# EAGLE schematic board (EAGLE 8.7.1)
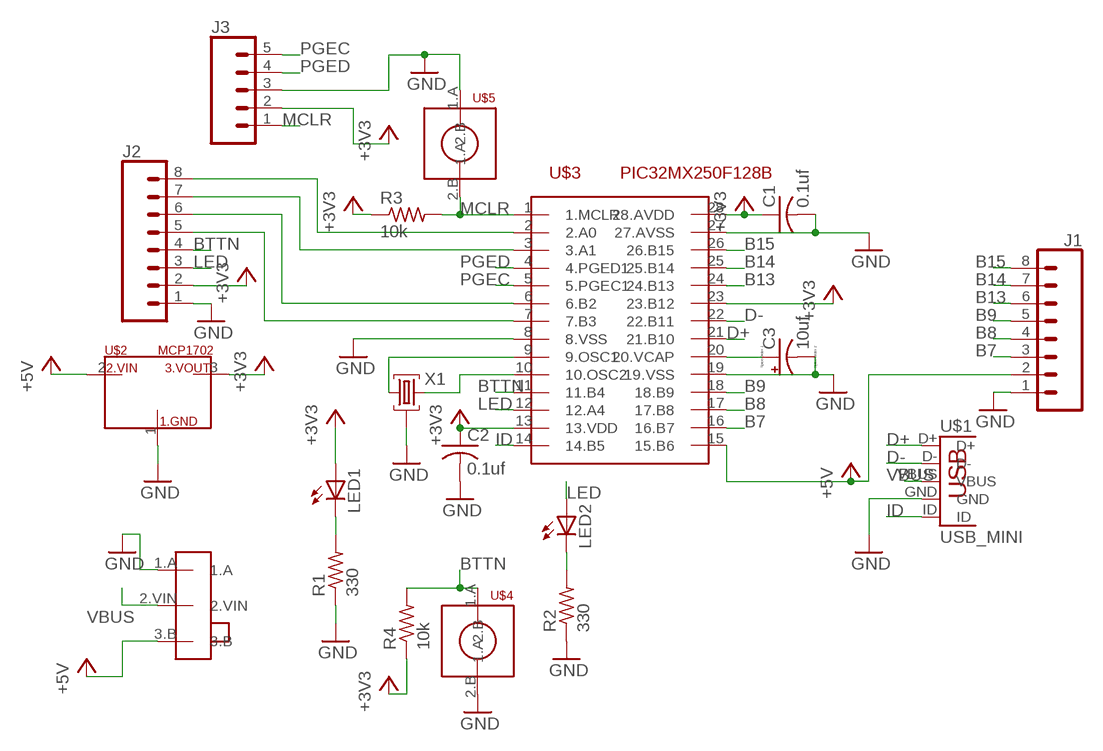
[diagram p0: schematic, sheet 1]

## Parts
C1  0.1uf  C-US025-025X050  [C025-025X050]
C2  0.1uf  C-US025-025X050  [C025-025X050]
C3  10uf  CPOL-USE2,5-6E  [E2,5-6E]
J1  CONN_08"  [1X08]
J2  CONN_08"  [1X08]
J3  CONN_05  [1X05]
LED1  LED5MM  [LED5MM]
LED2  LED5MM  [LED5MM]
R1  330  R-US_0204/5  [0204/5]
R2  330  R-US_0204/5  [0204/5]
R3  10k  R-US_0204/5  [0204/5]
R4  10k  R-US_0204/5  [0204/5]
U$1  USB_MINI  [USB-MB-H]
U$2  MCP1702  [TO92]
U$3  PIC32MX250F128B  [DIL28]
U$4  PUSH_BUTTON  [PUSH_BUTTON]
U$5  PUSH_BUTTON  [PUSH_BUTTON]
U$6  SLIDE_SWITCH  [SLIDE_SWITCH]
X1  HC49-HC49-3L  [HC49-3L]

## Nets
+3V3: C1.1 C2.1 J2.2 J3.2 LED1.A R3.1 R4.1 U$2.3(3.VOUT) U$3.13(13.VDD) U$3.23(23.B12) U$3.28(28.AVDD)
+5V: J1.2 U$2.2(2.VIN) U$3.15(15.B6) U$6.3.B
B7: J1.3 U$3.16(16.B7)
B8: J1.4 U$3.17(17.B8)
B9: J1.5 U$3.18(18.B9)
B13: J1.6 U$3.24(24.B13)
B14: J1.7 U$3.25(25.B14)
B15: J1.8 U$3.26(26.B15)
BTTN: J2.4 R4.2 U$3.11(11.B4) U$4.1.A
D+: U$1.D+ U$3.21(21.B10)
D-: U$1.D- U$3.22(22.B11)
GND: C1.2 C2.2 C3.- J1.1 J2.1 J3.3 R1.1 R2.1 U$1.GND U$2.1(1.GND) U$3.8(8.VSS) U$3.19(19.VSS) U$3.27(27.AVSS) U$4.2.B U$5.1.A U$6.1.A X1.2
ID: U$1.ID U$3.14(14.B5)
LED: J2.3 LED2.A U$3.12(12.A4)
MCLR: J3.1 R3.2 U$3.1(1.MCLR) U$5.2.B
N$1: LED1.K(C) R1.2
N$2: LED2.K(C) R2.2
N$3: U$3.10(10.OSC2) X1.3
N$4: U$3.9(9.OSC1) X1.1
N$6: C3.+ U$3.20(20.VCAP)
N$11: J2.8 U$3.2(2.A0)
N$12: J2.7 U$3.3(3.A1)
N$13: J2.6 U$3.6(6.B2)
N$14: J2.5 U$3.7(7.B3)
PGEC: J3.5 U$3.5(5.PGEC1)
PGED: J3.4 U$3.4(4.PGED1)
VBUS: U$1.VBUS U$6.2.VIN

## Library data of the parts
C1 C2 = me_433:C-US: CAPACITOR, American symbol
C3 = me_433:CPOL-US: POLARIZED CAPACITOR, American symbol
J1 J2 = me_433:CONN_08: Multi connection point. Often used as Generic Header-pin footprint for 0.1 inch spaced/style header connections On any of the 0.1 inch spaced packages, you can populate with these: Break Away Headers - Straight <https://www.sparkfun.com/products/116> (PRT-00116) Break Away Male Headers - Right Angle <https://www.sparkfun.com/products/553> (PRT-00553) Female Headers <https://www.sparkfun.com/products/115> (PRT-00115) Break Away Headers - Machine Pin <https://www.sparkfun.com/products/117> (PRT-00117) Break Away Female Headers - Swiss Machine Pin <https://www.sparkfun.com/products/743> (PRT-00743) Arduino Stackable Header - 8 Pin <https://www.sparkfun.com/products/9279> (PRT-09279) For SCREWTERMINALS and SPRING TERMINALS visit here: Screw Terimnals on SparkFun.com <https://www.sparkfun.com/search/results?term=Screw+Terminals> (5mm/3.5mm/2.54mm spacing) This device is also useful as a general connection point to wire up your design to another part of your project. Our various solder wires solder well into these plated through hole pads. Hook-Up Wire - Assortment (Stranded, 22 AWG) <https://www.sparkfun.com/products/11375> (PRT-11375) Hook-Up Wire - Assortment (Solid Core, 22 AWG) <https://www.sparkfun.com/products/11367> (PRT-11367) View the entire wire category on our website here <https://www.sparkfun.com/categories/141> Special notes: Molex polarized connector foot print use with SKU : PRT-08231 with associated crimp pins and housings. 1MM SMD Version SKU: PRT-10208 NOTES ON THE VARIANTS LOCK and LOCK_LONGPADS... This footprint was designed to help hold the alignment of a through-hole component (i.e. 6-pin header) while soldering it into place. You may notice that each hole has been shifted either up or down by 0.005 of an inch from it's more standard position (which is a perfectly straight line). This slight alteration caused the pins (the squares in the middle) to touch the edges of the holes. Because they are alternating, it causes a "brace" to hold the component in place. 0.005 has proven to be the perfect amount of "off-center" position when using our standard breakaway headers. Although looks a little odd when you look at the bare footprint, once you have a header in there, the alteration is very hard to notice. Also,if you push a header all the way into place, it is covered up entirely on the bottom side.; PROD_ID: CONN-08438
J3 = me_433:CONN_05: Multi connection point. Often used as Generic Header-pin footprint for 0.1 inch spaced/style header connections On any of the 0.1 inch spaced packages, you can populate with these: Break Away Headers - Straight <https://www.sparkfun.com/products/116> (PRT-00116) Break Away Male Headers - Right Angle <https://www.sparkfun.com/products/553> (PRT-00553) Female Headers <https://www.sparkfun.com/products/115> (PRT-00115) Break Away Headers - Machine Pin <https://www.sparkfun.com/products/117> (PRT-00117) Break Away Female Headers - Swiss Machine Pin <https://www.sparkfun.com/products/743> (PRT-00743) For SCREWTERMINALS and SPRING TERMINALS visit here: Screw Terimnals on SparkFun.com <https://www.sparkfun.com/search/results?term=Screw+Terminals> (5mm/3.5mm/2.54mm spacing) This device is also useful as a general connection point to wire up your design to another part of your project. Our various solder wires solder well into these plated through hole pads. Hook-Up Wire - Assortment (Stranded, 22 AWG) <https://www.sparkfun.com/products/11375> (PRT-11375) Hook-Up Wire - Assortment (Solid Core, 22 AWG) <https://www.sparkfun.com/products/11367> (PRT-11367) View the entire wire category on our website here <https://www.sparkfun.com/categories/141> Special notes: Molex polarized connector foot print use with SKU : PRT-08231 with associated crimp pins and housings. 1MM SMD Version SKU: PRT-10208
LED1 LED2 = led:LED: LED OSRAM: - CHIPLED LG R971, LG N971, LY N971, LG Q971, LY Q971, LO R971, LY R971 LH N974, LH R974 LS Q976, LO Q976, LY Q976 LO Q996 - Hyper CHIPLED LW Q18S LB Q993, LB Q99A, LB R99A - SideLED LS A670, LO A670, LY A670, LG A670, LP A670 LB A673, LV A673, LT A673, LW A673 LH A674 LY A675 LS A676, LA A676, LO A676, LY A676, LW A676 LS A679, LY A679, LG A679 - Hyper Micro SIDELED® LS Y876, LA Y876, LO Y876, LY Y876 LT Y87S - SmartLED LW L88C, LW L88S LB L89C, LB L89S, LG L890 LS L89K, LO L89K, LY L89K LS L896, LA L896, LO L896, LY L896 - TOPLED LS T670, LO T670, LY T670, LG T670, LP T670 LSG T670, LSP T670, LSY T670, LOP T670, LYG T670 LG T671, LOG T671, LSG T671 LB T673, LV T673, LT T673, LW T673 LH T674 LS T676, LA T676, LO T676, LY T676, LB T676, LH T676, LSB T676, LW T676 LB T67C, LV T67C, LT T67C, LS T67K, LO T67K, LY T67K, LW E67C LS E67B, LA E67B, LO E67B, LY E67B, LB E67C, LV E67C, LT E67C LW T67C LS T679, LY T679, LG T679 LS T770, LO T770, LY T770, LG T770, LP T770 LB T773, LV T773, LT T773, LW T773 LH T774 LS E675, LA E675, LY E675, LS T675 LS T776, LA T776, LO T776, LY T776, LB T776 LHGB T686 LT T68C, LB T68C - Hyper Mini TOPLED® LB M676 - Mini TOPLED Santana® LG M470 LS M47K, LO M47K, LY M47K Source: http://www.osram.convergy.de LUXEON: - LUMILED® LXK2-PW12-R00, LXK2-PW12-S00, LXK2-PW14-U00, LXK2-PW14-V00 LXK2-PM12-R00, LXK2-PM12-S00, LXK2-PM14-U00 LXK2-PE12-Q00, LXK2-PE12-R00, LXK2-PE12-S00, LXK2-PE14-T00, LXK2-PE14-U00 LXK2-PB12-K00, LXK2-PB12-L00, LXK2-PB12-M00, LXK2-PB14-N00, LXK2-PB14-P00, LXK2-PB14-Q00 LXK2-PR12-L00, LXK2-PR12-M00, LXK2-PR14-Q00, LXK2-PR14-R00 LXK2-PD12-Q00, LXK2-PD12-R00, LXK2-PD12-S00 LXK2-PH12-R00, LXK2-PH12-S00 LXK2-PL12-P00, LXK2-PL12-Q00, LXK2-PL12-R00 Source: www.luxeon.com KINGBRIGHT: KA-3528ASYC Source: www.kingbright.com
R1-R4 = resistor:R-US_: RESISTOR, American symbol
U$1 = usb_conn:USB_MINI
U$2 = me_433:MCP1702
U$3 = me_433:PIC32MX250F128B
U$4 U$5 = me_433:PUSH_BUTTON
U$6 = me_433:SLIDE_SWITCH
X1 = me_433:HC49: Crystals; MFD: IQD Frequency Products